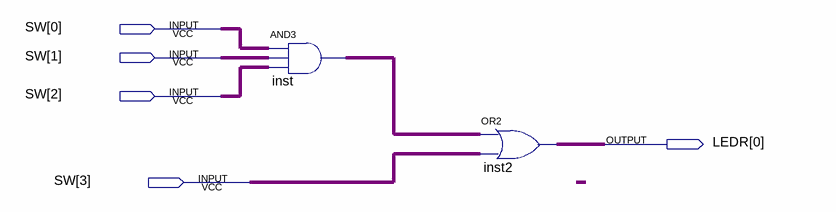
[diagram p0: schematic sheet]
// Quartus schematic Combinatorial_Logic.bdf as structural Verilog: 2 symbols, 5 pins
module Combinatorial_Logic (
  input  [3:0] SW,
  output [0:0] LEDR
);

  wire inst_out;

  and inst (inst_out, SW[0], SW[1], SW[2]);
  or inst2 (LEDR[0], inst_out, SW[3]);
endmodule
